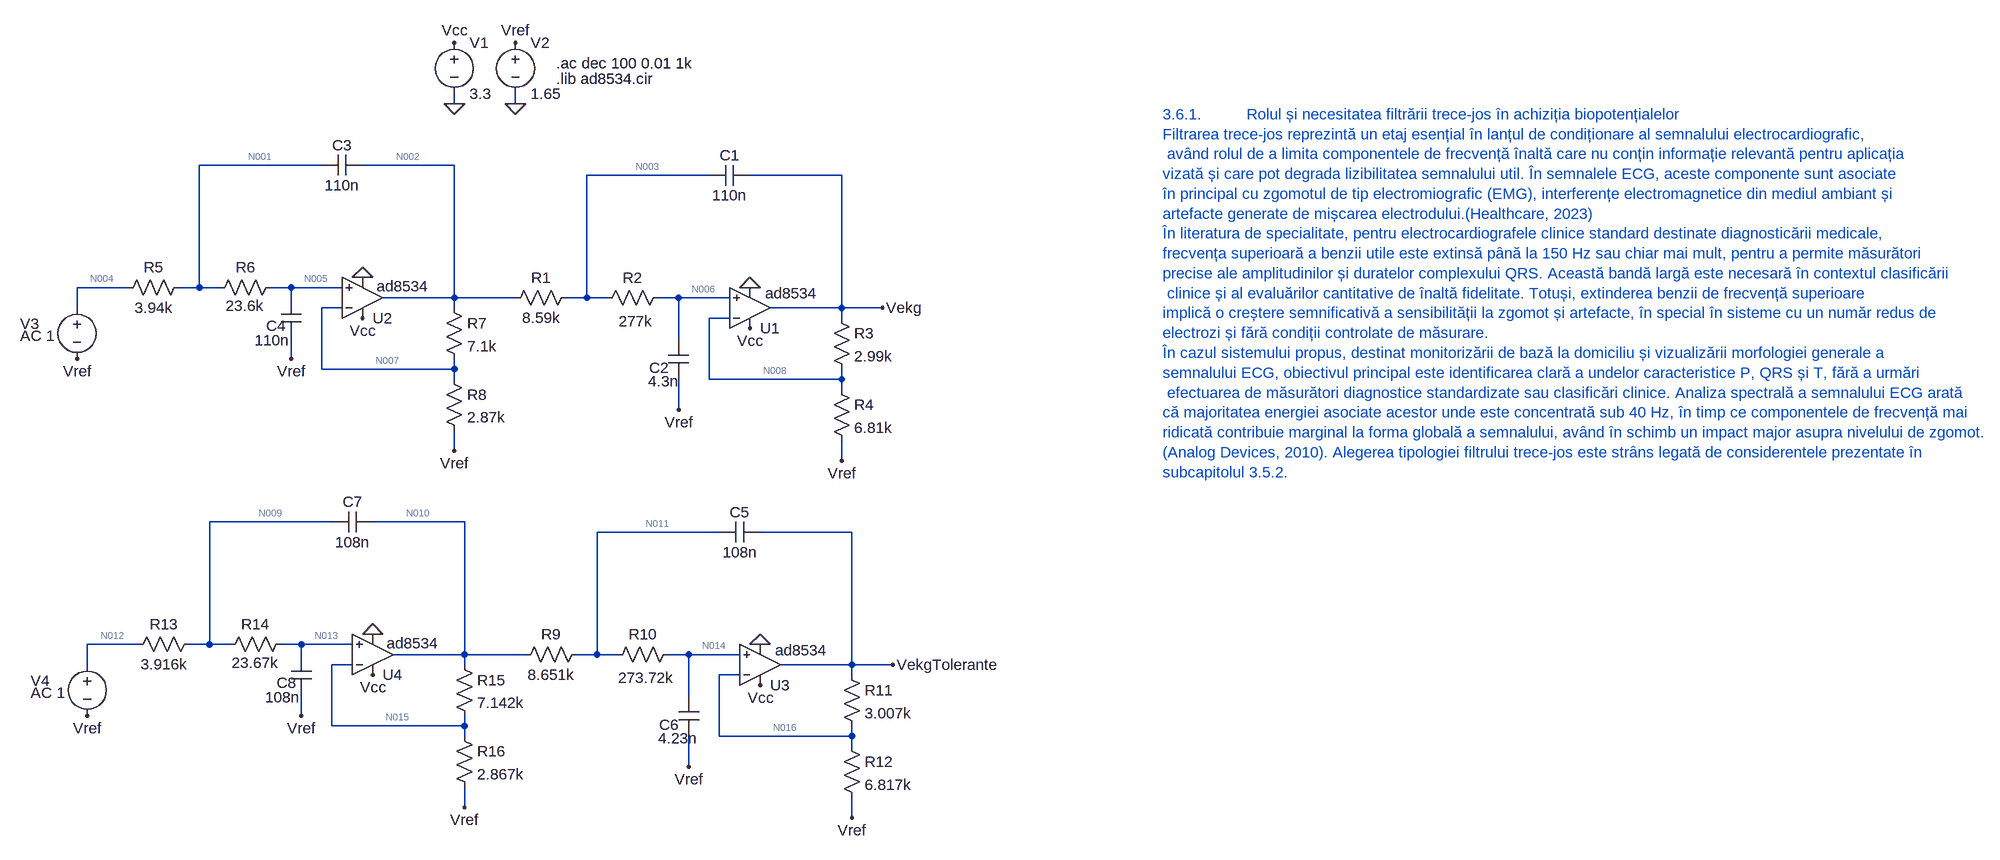
[diagram p0: schematic FTJ.asc]
FTJ.asc, the LTspice schematic file:
Version 4.1
SHEET 1 2280 1184
WIRE -48 -288 -48 -304
WIRE 48 -288 48 -304
WIRE -256 -192 -448 -192
WIRE -48 -192 -192 -192
WIRE 352 -176 160 -176
WIRE 560 -176 416 -176
WIRE -560 0 -640 0
WIRE -448 0 -448 -192
WIRE -448 0 -480 0
WIRE -416 0 -448 0
WIRE -304 0 -336 0
WIRE -224 0 -304 0
WIRE -304 16 -304 0
WIRE -48 16 -48 -192
WIRE -48 16 -160 16
WIRE 48 16 -48 16
WIRE 160 16 160 -176
WIRE 160 16 128 16
WIRE 192 16 160 16
WIRE 304 16 272 16
WIRE 384 16 304 16
WIRE -640 32 -640 0
WIRE -224 32 -256 32
WIRE -48 32 -48 16
WIRE 560 32 560 -176
WIRE 560 32 448 32
WIRE 624 32 560 32
WIRE 384 48 352 48
WIRE 560 48 560 32
WIRE 304 80 304 16
WIRE -304 112 -304 80
WIRE -256 128 -256 32
WIRE -48 128 -48 112
WIRE -48 128 -256 128
WIRE -48 144 -48 128
WIRE 352 144 352 48
WIRE 560 144 560 128
WIRE 560 144 352 144
WIRE 560 160 560 144
WIRE 304 192 304 144
WIRE -48 256 -48 224
WIRE 560 272 560 240
WIRE -240 368 -432 368
WIRE -32 368 -176 368
WIRE 368 384 176 384
WIRE 576 384 432 384
WIRE -544 560 -624 560
WIRE -432 560 -432 368
WIRE -432 560 -464 560
WIRE -400 560 -432 560
WIRE -288 560 -320 560
WIRE -208 560 -288 560
WIRE -288 576 -288 560
WIRE -32 576 -32 368
WIRE -32 576 -144 576
WIRE 64 576 -32 576
WIRE 176 576 176 384
WIRE 176 576 144 576
WIRE 208 576 176 576
WIRE 320 576 288 576
WIRE 400 576 320 576
WIRE -624 592 -624 560
WIRE -208 592 -240 592
WIRE -32 592 -32 576
WIRE 576 592 576 384
WIRE 576 592 464 592
WIRE 640 592 576 592
WIRE 400 608 368 608
WIRE 576 608 576 592
WIRE 320 640 320 576
WIRE -288 672 -288 640
WIRE -240 688 -240 592
WIRE -32 688 -32 672
WIRE -32 688 -240 688
WIRE -32 704 -32 688
WIRE 368 704 368 608
WIRE 576 704 576 688
WIRE 576 704 368 704
WIRE 576 720 576 704
WIRE 320 752 320 704
WIRE -32 816 -32 784
WIRE 576 832 576 800
FLAG -48 -288 0
FLAG -48 -384 Vcc
FLAG 48 -288 0
FLAG 48 -384 Vref
FLAG -640 112 Vref
FLAG 304 192 Vref
FLAG 416 0 0
FLAG 416 64 Vcc
FLAG 624 32 Vekg
FLAG 560 272 Vref
FLAG -304 112 Vref
FLAG -192 -16 0
FLAG -192 48 Vcc
FLAG -48 256 Vref
FLAG -624 672 Vref
FLAG 320 752 Vref
FLAG 432 560 0
FLAG 432 624 Vcc
FLAG 640 592 VekgTolerante
FLAG 576 832 Vref
FLAG -288 672 Vref
FLAG -176 544 0
FLAG -176 608 Vcc
FLAG -32 816 Vref
SYMBOL voltage -48 -400 R0
SYMATTR InstName V1
SYMATTR Value 3.3
SYMBOL voltage 48 -400 R0
SYMATTR InstName V2
SYMATTR Value 1.65
SYMBOL voltage -640 16 R0
WINDOW 0 -89 41 Left 2
WINDOW 123 -89 60 Left 2
WINDOW 39 0 0 Left 0
SYMATTR InstName V3
SYMATTR Value2 AC 1
SYMATTR Value ""
SYMBOL res 144 0 R90
WINDOW 0 0 56 VBottom 2
WINDOW 3 32 56 VTop 2
SYMATTR InstName R1
SYMATTR Value 8.59k
SYMBOL res 288 0 R90
WINDOW 0 0 56 VBottom 2
WINDOW 3 37 52 VTop 2
SYMATTR InstName R2
SYMATTR Value 277k
SYMBOL cap 416 -192 R90
WINDOW 0 0 32 VBottom 2
WINDOW 3 32 32 VTop 2
SYMATTR InstName C1
SYMATTR Value 110n
SYMBOL OpAmps\\opamp2 416 96 M180
WINDOW 3 24 87 Left 2
SYMATTR Value ad8534
SYMATTR InstName U1
SYMBOL cap 288 80 R0
WINDOW 0 -30 46 Left 2
WINDOW 3 -32 67 Left 2
SYMATTR InstName C2
SYMATTR Value 4.3n
SYMBOL res 544 32 R0
SYMATTR InstName R3
SYMATTR Value 2.99k
SYMBOL res 544 144 R0
SYMATTR InstName R4
SYMATTR Value 6.81k
SYMBOL res -464 -16 R90
WINDOW 0 0 56 VBottom 2
WINDOW 3 32 56 VTop 2
SYMATTR InstName R5
SYMATTR Value 3.94k
SYMBOL res -320 -16 R90
WINDOW 0 0 56 VBottom 2
WINDOW 3 29 57 VTop 2
SYMATTR InstName R6
SYMATTR Value 23.6k
SYMBOL cap -192 -208 R90
WINDOW 0 0 32 VBottom 2
WINDOW 3 32 32 VTop 2
SYMATTR InstName C3
SYMATTR Value 110n
SYMBOL OpAmps\\opamp2 -192 80 M180
WINDOW 3 22 82 Left 2
SYMATTR Value ad8534
SYMATTR InstName U2
SYMBOL cap -320 16 R0
WINDOW 0 -23 44 Left 2
WINDOW 3 -41 67 Left 2
SYMATTR InstName C4
SYMATTR Value 110n
SYMBOL res -64 16 R0
SYMATTR InstName R7
SYMATTR Value 7.1k
SYMBOL res -64 128 R0
SYMATTR InstName R8
SYMATTR Value 2.87k
SYMBOL voltage -624 576 R0
WINDOW 0 -89 41 Left 2
WINDOW 123 -89 60 Left 2
WINDOW 39 0 0 Left 0
SYMATTR InstName V4
SYMATTR Value2 AC 1
SYMATTR Value ""
SYMBOL res 160 560 R90
WINDOW 0 0 56 VBottom 2
WINDOW 3 32 56 VTop 2
SYMATTR InstName R9
SYMATTR Value 8.651k
SYMBOL res 304 560 R90
WINDOW 0 0 56 VBottom 2
WINDOW 3 37 52 VTop 2
SYMATTR InstName R10
SYMATTR Value 273.72k
SYMBOL cap 432 368 R90
WINDOW 0 0 32 VBottom 2
WINDOW 3 32 32 VTop 2
SYMATTR InstName C5
SYMATTR Value 108n
SYMBOL OpAmps\\opamp2 432 656 M180
WINDOW 3 24 87 Left 2
SYMATTR Value ad8534
SYMATTR InstName U3
SYMBOL cap 304 640 R0
WINDOW 0 -30 46 Left 2
WINDOW 3 -32 67 Left 2
SYMATTR InstName C6
SYMATTR Value 4.23n
SYMBOL res 560 592 R0
SYMATTR InstName R11
SYMATTR Value 3.007k
SYMBOL res 560 704 R0
SYMATTR InstName R12
SYMATTR Value 6.817k
SYMBOL res -448 544 R90
WINDOW 0 0 56 VBottom 2
WINDOW 3 32 56 VTop 2
SYMATTR InstName R13
SYMATTR Value 3.916k
SYMBOL res -304 544 R90
WINDOW 0 0 56 VBottom 2
WINDOW 3 29 57 VTop 2
SYMATTR InstName R14
SYMATTR Value 23.67k
SYMBOL cap -176 352 R90
WINDOW 0 0 32 VBottom 2
WINDOW 3 32 32 VTop 2
SYMATTR InstName C7
SYMATTR Value 108n
SYMBOL OpAmps\\opamp2 -176 640 M180
WINDOW 3 22 82 Left 2
SYMATTR Value ad8534
SYMATTR InstName U4
SYMBOL cap -304 576 R0
WINDOW 0 -23 44 Left 2
WINDOW 3 -41 67 Left 2
SYMATTR InstName C8
SYMATTR Value 108n
SYMBOL res -48 576 R0
SYMATTR InstName R15
SYMATTR Value 7.142k
SYMBOL res -48 688 R0
SYMATTR InstName R16
SYMATTR Value 2.867k
TEXT 112 -352 Left 2 !.ac dec 100 0.01 1k
TEXT 112 -328 Left 2 !.lib ad8534.cir
TEXT 1064 -272 Left 2 ;3.6.1.          Rolul și necesitatea filtrării trece-jos în achiziția biopotențialelor\nFiltrarea trece-jos reprezintă un etaj esențial în lanțul de condiționare al semnalului electrocardiografic,\n având rolul de a limita componentele de frecvență înaltă care nu conțin informație relevantă pentru aplicația \nvizată și care pot degrada lizibilitatea semnalului util. În semnalele ECG, aceste componente sunt asociate \nîn principal cu zgomotul de tip electromiografic (EMG), interferențe electromagnetice din mediul ambiant și \nartefacte generate de mișcarea electrodului.(Healthcare, 2023)\nÎn literatura de specialitate, pentru electrocardiografele clinice standard destinate diagnosticării medicale, \nfrecvența superioară a benzii utile este extinsă până la 150 Hz sau chiar mai mult, pentru a permite măsurători \nprecise ale amplitudinilor și duratelor complexului QRS. Această bandă largă este necesară în contextul clasificării\n clinice și al evaluărilor cantitative de înaltă fidelitate. Totuși, extinderea benzii de frecvență superioare \nimplică o creștere semnificativă a sensibilității la zgomot și artefacte, în special în sisteme cu un număr redus de \nelectrozi și fără condiții controlate de măsurare.\nÎn cazul sistemului propus, destinat monitorizării de bază la domiciliu și vizualizării morfologiei generale a \nsemnalului ECG, obiectivul principal este identificarea clară a undelor caracteristice P, QRS și T, fără a urmări\n efectuarea de măsurători diagnostice standardizate sau clasificări clinice. Analiza spectrală a semnalului ECG arată \ncă majoritatea energiei asociate acestor unde este concentrată sub 40 Hz, în timp ce componentele de frecvență mai \nridicată contribuie marginal la forma globală a semnalului, având în schimb un impact major asupra nivelului de zgomot.\n(Analog Devices, 2010). Alegerea tipologiei filtrului trece-jos este strâns legată de considerentele prezentate în \nsubcapitolul 3.5.2.

The netlist it stands for:
* FTJ.asc
V1 Vcc 0 3.3
V2 Vref 0 1.65
V3 N004 Vref AC 1
R1 N003 N002 8.59k
R2 N006 N003 277k
C1 Vekg N003 110n
X§U1 N006 N008 Vcc 0 Vekg ad8534  ; pins In+ In- V+ V- OUT
C2 N006 Vref 4.3n
R3 Vekg N008 2.99k
R4 N008 Vref 6.81k
R5 N001 N004 3.94k
R6 N005 N001 23.6k
C3 N002 N001 110n
X§U2 N005 N007 Vcc 0 N002 ad8534  ; pins In+ In- V+ V- OUT
C4 N005 Vref 110n
R7 N002 N007 7.1k
R8 N007 Vref 2.87k
V4 N012 Vref AC 1
R9 N011 N010 8.651k
R10 N014 N011 273.72k
C5 VekgTolerante N011 108n
X§U3 N014 N016 Vcc 0 VekgTolerante ad8534  ; pins In+ In- V+ V- OUT
C6 N014 Vref 4.23n
R11 VekgTolerante N016 3.007k
R12 N016 Vref 6.817k
R13 N009 N012 3.916k
R14 N013 N009 23.67k
C7 N010 N009 108n
X§U4 N013 N015 Vcc 0 N010 ad8534  ; pins In+ In- V+ V- OUT
C8 N013 Vref 108n
R15 N010 N015 7.142k
R16 N015 Vref 2.867k
.ac dec 100 0.01 1k
.lib ad8534.cir
* 3.6.1.          Rolul și necesitatea filtrării trece-jos în achiziția biopotențialelor
* Filtrarea trece-jos reprezintă un etaj esențial în lanțul de condiționare al semnalului electrocardiografic,
*  având rolul de a limita componentele de frecvență înaltă care nu conțin informație relevantă pentru aplicația
* vizată și care pot degrada lizibilitatea semnalului util. În semnalele ECG, aceste componente sunt asociate
* în principal cu zgomotul de tip electromiografic (EMG), interferențe electromagnetice din mediul ambiant și
* artefacte generate de mișcarea electrodului.(Healthcare, 2023)
* În literatura de specialitate, pentru electrocardiografele clinice standard destinate diagnosticării medicale,
* frecvența superioară a benzii utile este extinsă până la 150 Hz sau chiar mai mult, pentru a permite măsurători
* precise ale amplitudinilor și duratelor complexului QRS. Această bandă largă este necesară în contextul clasificării
*  clinice și al evaluărilor cantitative de înaltă fidelitate. Totuși, extinderea benzii de frecvență superioare
* implică o creștere semnificativă a sensibilității la zgomot și artefacte, în special în sisteme cu un număr redus de
* electrozi și fără condiții controlate de măsurare.
* În cazul sistemului propus, destinat monitorizării de bază la domiciliu și vizualizării morfologiei generale a
* semnalului ECG, obiectivul principal este identificarea clară a undelor caracteristice P, QRS și T, fără a urmări
*  efectuarea de măsurători diagnostice standardizate sau clasificări clinice. Analiza spectrală a semnalului ECG arată
* că majoritatea energiei asociate acestor unde este concentrată sub 40 Hz, în timp ce componentele de frecvență mai
* ridicată contribuie marginal la forma globală a semnalului, având în schimb un impact major asupra nivelului de zgomot.
* (Analog Devices, 2010). Alegerea tipologiei filtrului trece-jos este strâns legată de considerentele prezentate în
* subcapitolul 3.5.2.
.backanno
.end

* Results of the author's LTspice run, read from the files saved beside the schematic
* Operating Point, zero values left out:
*   V(n001) = 1.65 V
*   V(n002) = 1.667 V
*   V(n003) = 1.667 V
*   V(n004) = 1.65 V
*   V(n005) = 1.65 V
*   V(n006) = 1.667 V
*   V(n007) = 1.655 V
*   V(n008) = 1.672 V
*   V(n009) = 1.65 V
*   V(n010) = 1.667 V
*   V(n011) = 1.667 V
*   V(n012) = 1.65 V
*   V(n013) = 1.65 V
*   V(n014) = 1.667 V
*   V(n015) = 1.655 V
*   V(n016) = 1.673 V
*   V(vcc) = 3.3 V
*   V(vekg) = 1.682 V
*   V(vekgtolerante) = 1.683 V
*   V(vref) = 1.65 V
*   I(R1) = -4.5 pA
*   I(R10) = -4.5 pA
*   I(R11) = 3.313 µA
*   I(R12) = 3.313 µA
*   I(R13) = -4.5 pA
*   I(R14) = -4.5 pA
*   I(R15) = 1.748 µA
*   I(R16) = 1.748 µA
*   I(R2) = -4.5 pA
*   I(R3) = 3.303 µA
*   I(R4) = 3.303 µA
*   I(R5) = -4.5 pA
*   I(R6) = -4.5 pA
*   I(R7) = 1.746 µA
*   I(R8) = 1.746 µA
*   I(R9) = -4.5 pA
*   I(V1) = -2.352 mA
*   I(V2) = 10.11 µA
*   I(V3) = -4.5 pA
*   I(V4) = -4.5 pA
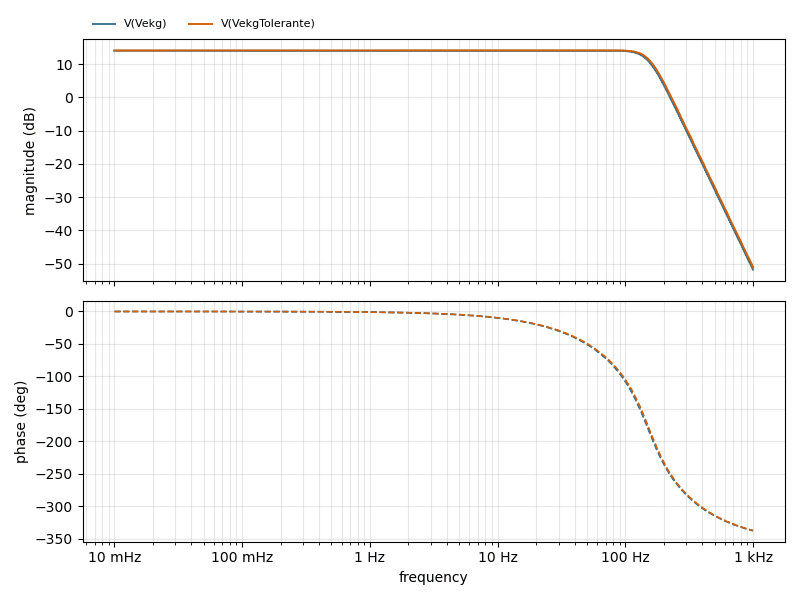
[diagram p1: AC Analysis of FTJ.asc, plotted from the saved traces]
* AC Analysis, 1 run:
*   V(Vekg): 14.06 dB at 10 mHz, -51.85 dB at 1 kHz, peak 14.08 dB at 66.07 Hz, 3 dB below the peak at 150.6 Hz
*   V(VekgTolerante): 14.11 dB at 10 mHz, -51.11 dB at 1 kHz, peak 14.15 dB at 75.86 Hz, 3 dB below the peak at 154.7 Hz